# EAGLE design devboard (EAGLE 5.11)
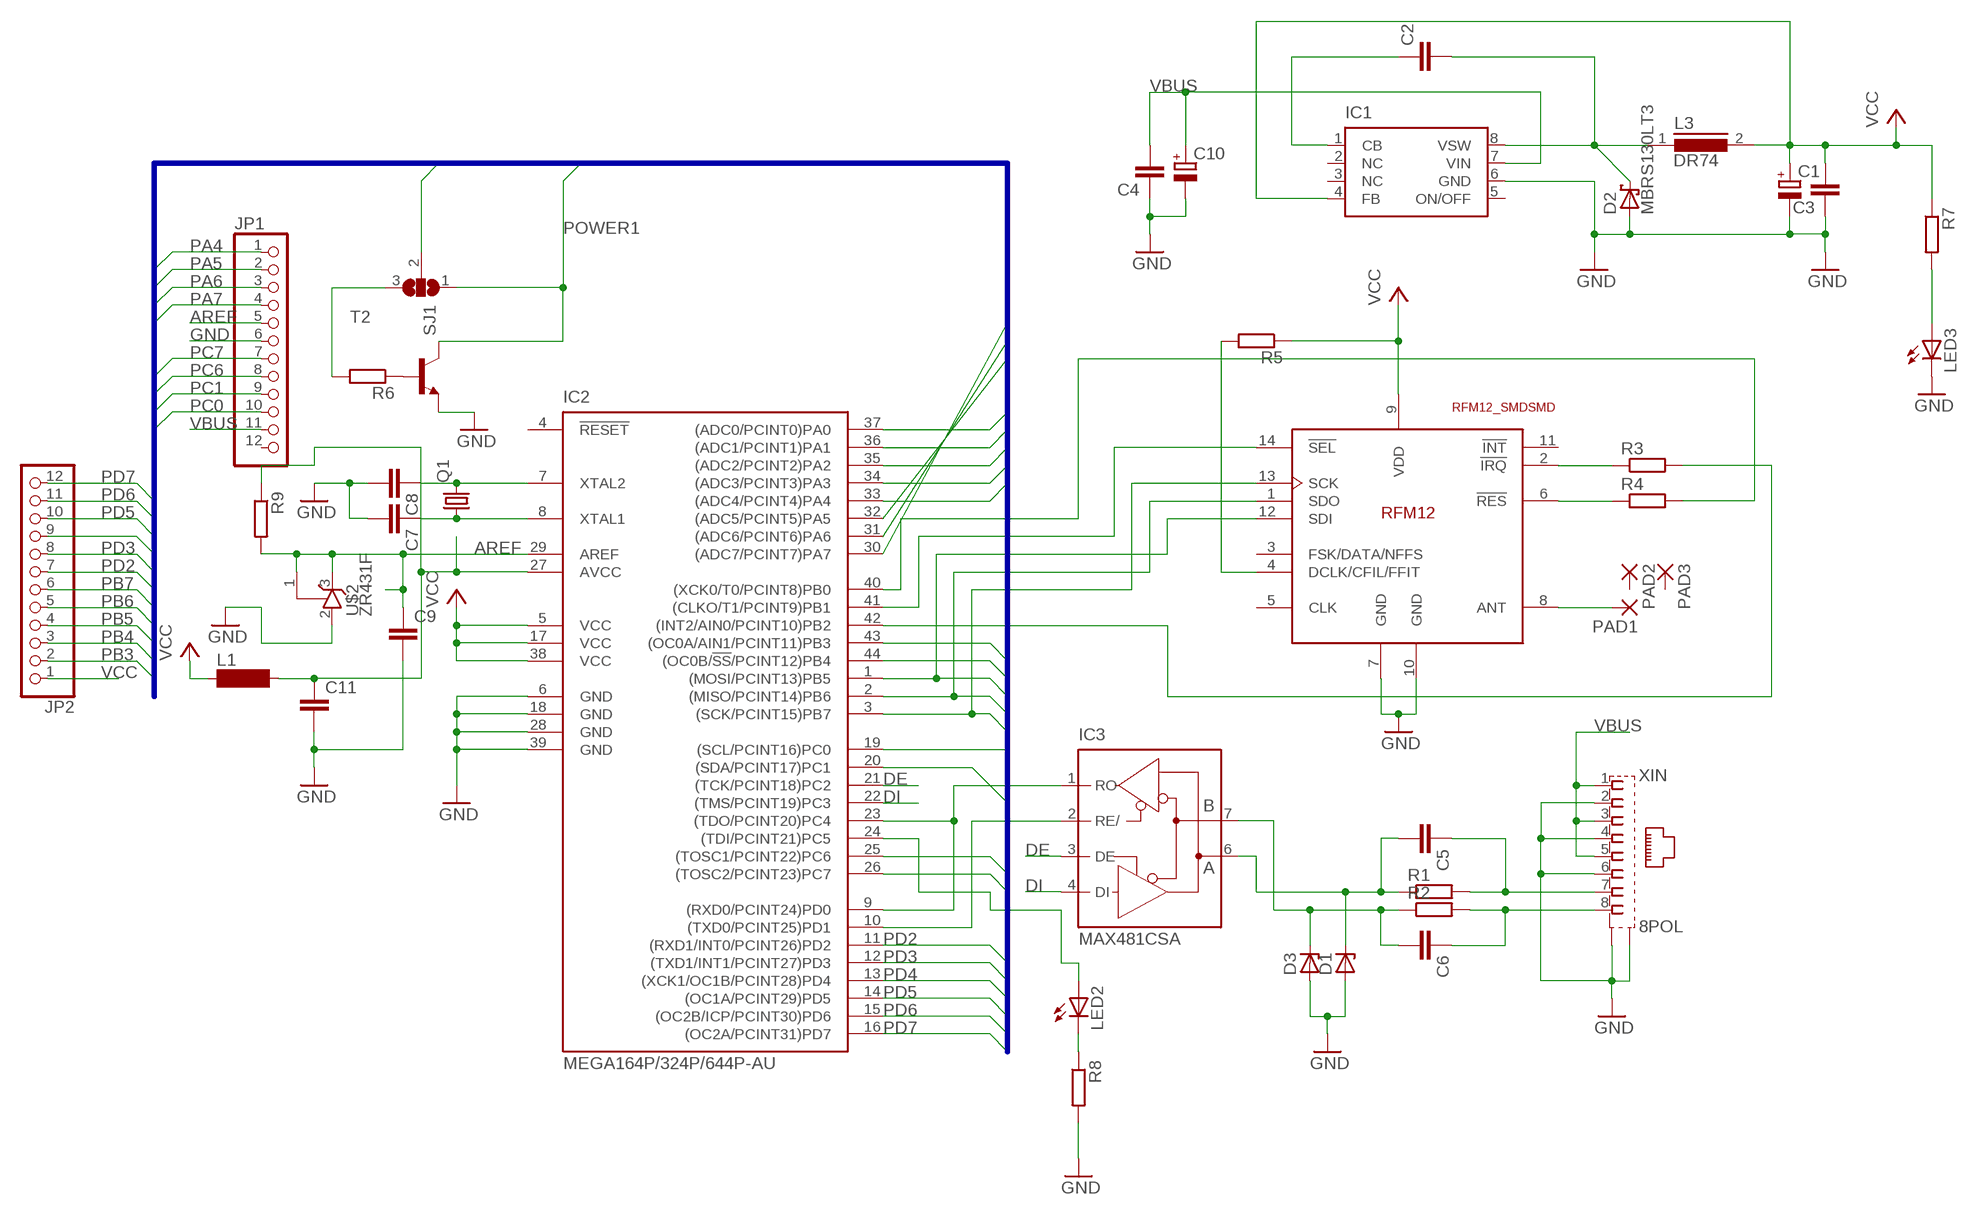
[diagram p0: schematic, sheet 1]

## Parts
C1  CPOL-EUE2.5-5  [E2,5-5]
C2  C-EUC0805K  [C0805K]
C3  C-EUC0805K  [C0805K]
C4  C-EUC0805K  [C0805K]
C5  C-EUC0805K  [C0805K]
C6  C-EUC0805K  [C0805K]
C7  C-EUC0805K  [C0805K]
C8  C-EUC0805K  [C0805K]
C9  C-EUC0805K  [C0805K]
C10  CPOL-EUE2.5-5  [E2,5-5]
C11  C-EUC0805K  [C0805K]
D1  ZENER-DIODESOD80C  [SOD80C]
D2  MBRS130LT3  [SMB]
D3  ZENER-DIODESOD80C  [SOD80C]
IC1  LM2674  [SO8]
IC2  MEGA164P/324P/644P-AU  [TQFP44]
IC3  MAX481CSA  [SO08]
JP1  PINHD-1X12  [1X12]
JP2  PINHD-1X12  [1X12]
L1  SM-1206  [SM-1206]
L3  DR74  [DR74]
LED2  LEDCHIPLED_0805  [CHIPLED_0805]
LED3  LEDCHIPLED_0805  [CHIPLED_0805]
PAD1  SMD2  [SMD1,27-2,54]
PAD2  SMD2  [SMD1,27-2,54]
PAD3  SMD2  [SMD1,27-2,54]
Q1  CRYSTALHC49UP  [HC49UP]
R1  R-EU_R0805  [R0805]
R2  R-EU_R0805  [R0805]
R3  R-EU_R0805  [R0805]
R4  R-EU_R0805  [R0805]
R5  R-EU_R0805  [R0805]
R6  R-EU_R0805  [R0805]
R7  R-EU_R0805  [R0805]
R8  R-EU_R0805  [R0805]
R9  R-EU_R0805  [R0805]
SJ1  SJ2W  [SJ_2]
T2  MMBT2222ALT1-NPN-SOT23-BEC  [SOT23-BEC]
U$1  RFM12_SMDSMD  [RFM12]
U$2  ZR431F  [SOT32]
XIN  8POL  [8POL]

## Nets
AREF: C9.1 IC2.29(AREF) JP1.5 R9.2 U$2.1(R) U$2.3(C)
AVCC: C11.1 IC2.27(AVCC) L1.2 R9.1
DE: IC2.21((TCK/PCINT18)PC2) IC3.3(DE)
DI: IC2.22((TMS/PCINT19)PC3) IC3.4(DI)
GND: C1.- C3.1 C4.1 C7.2 C8.2 C9.2 C10.- C11.2 D1.A D2.A D3.A IC1.6(GND) IC2.6(GND) IC2.18(GND) IC2.28(GND) IC2.39(GND) JP1.6 LED3.C R8.2 T2.E U$1.7(GND) U$1.10(GND) U$2.2(A) XIN.2 XIN.4 XIN.6 XIN.S1 XIN.S2
N$1: C7.1 IC2.8(XTAL1) Q1.1
N$2: C8.1 IC2.7(XTAL2) Q1.2
N$3: IC2.9((RXD0/PCINT24)PD0) IC2.23((TDO/PCINT20)PC4) IC3.1(RO)
N$4: IC2.10((TXD0/PCINT25)PD1) IC3.2(RE/)
N$6: R4.1 U$1.6(!RES)
N$7: R3.1 U$1.2(!IRQ)
N$8: IC2.41((CLKO/T1/PCINT9)PB1) U$1.14(!SEL)
N$9: C2.2 D2.C IC1.8(VSW) L3.1
N$10: C2.1 IC1.1(CB)
N$11: C5.2 D1.C IC3.6(A) R1.1
N$12: R6.2 SJ1.3
N$13: C6.2 D3.C IC3.7(B) R2.1
N$14: IC2.42((INT2/AIN0/PCINT10)PB2) R3.2
N$15: C5.1 R1.2 XIN.7
N$16: C6.1 R2.2 XIN.8
N$17: IC2.40((XCK0/T0/PCINT8)PB0) R4.2
N$18: PAD1.1(P) U$1.8(ANT)
N$19: R5.2 U$1.4(DCLK/CFIL/FFIT)
N$20: R6.1 T2.B
N$21: LED3.A R7.2
N$22: IC2.24((TDI/PCINT21)PC5) LED2.A
N$23: LED2.C R8.1
PA0: IC2.37((ADC0/PCINT0)PA0)
PA1: IC2.36((ADC1/PCINT1)PA1)
PA2: IC2.35((ADC2/PCINT2)PA2)
PA3: IC2.34((ADC3/PCINT3)PA3)
PA4: IC2.33((ADC4/PCINT4)PA4) JP1.1
PA5: IC2.32((ADC5/PCINT5)PA5) JP1.2
PA6: IC2.31((ADC6/PCINT6)PA6) JP1.3
PA7: IC2.30((ADC7/PCINT7)PA7) JP1.4
PB3: IC2.43((OC0A/AIN1/PCINT11)PB3) JP2.2
PB4: IC2.44((OC0B/!SS!/PCINT12)PB4) JP2.3
PB5: IC2.1((MOSI/PCINT13)PB5) JP2.4 U$1.12(SDI)
PB6: IC2.2((MISO/PCINT14)PB6) JP2.5 U$1.1(SDO)
PB7: IC2.3((SCK/PCINT15)PB7) JP2.6 U$1.13(SCK)
PC0: IC2.19((SCL/PCINT16)PC0) JP1.10
PC1: IC2.20((SDA/PCINT17)PC1) JP1.9
PC6: IC2.25((TOSC1/PCINT22)PC6) JP1.8
PC7: IC2.26((TOSC2/PCINT23)PC7) JP1.7
PD2: IC2.11((RXD1/INT0/PCINT26)PD2) JP2.7
PD3: IC2.12((TXD1/INT1/PCINT27)PD3) JP2.8
PD4: IC2.13((XCK1/OC1B/PCINT28)PD4) SJ1.2
PD5: IC2.14((OC1A/PCINT29)PD5) JP2.10
PD6: IC2.15((OC2B/ICP/PCINT30)PD6) JP2.11
PD7: IC2.16((OC2A/PCINT31)PD7) JP2.12
POWER1: JP2.9 SJ1.1 T2.C
VBUS: C4.2 C10.+ IC1.7(VIN) JP1.11 XIN.1 XIN.3 XIN.5
VCC: C1.+ C3.2 IC1.4(FB) IC2.5(VCC) IC2.17(VCC) IC2.38(VCC) JP2.1 L1.1 L3.2 R5.1 R7.1 U$1.9(VDD)
Unconnected: IC1.2(NC) IC1.3(NC) IC1.5(ON/OFF) IC2.4(!RESET) JP1.12 PAD2.1(P) PAD3.1(P) U$1.3(FSK/DATA/NFFS) U$1.5(CLK) U$1.11(!INT)

## Buses
PA[0..7],PB[0..7],PC[0..7],PD[0..7],POWER1,POWER2

## Power pins joined to a net without a drawn wire
GND: IC3.5(GND)
VCC: IC3.8(VCC)

## Library data of the parts
C1 C10 = rcl:CPOL-EU: POLARIZED CAPACITOR, European symbol
C2-C9 C11 = rcl:C-EU: CAPACITOR, European symbol
D1 D3 = diode:ZENER-DIODE: Z-Diode
D2 = diode:MBRS130LT3: Schottky Power Rectifier Source: http://www.onsemi.com/pub/Collateral/MBRS130LT3-D.PDF
IC1 = lm2674:LM2674
IC2 = avr-6:MEGA164P/324P/644P-AU
IC3 = maxim:MAX481CSA: RS485 TRANSEIVER; MF: MAXIM; MPN: MAX481CSA; OC_FARNELL: unknown; OC_NEWARK: 90C3817
JP1 JP2 = pinhead:PINHD-1X12: PIN HEADER
L1 = inductor-neosid:SM-1206: INDUCTOR SMD chip inductor; OC_FARNELL: unknown; OC_NEWARK: unknown
L3 = inductors:DR74: High Power Density, High Efficiency, Shielded Inductors Source: coiltronics_dr_series.pdf
LED2 LED3 = led:LED: LED OSRAM: - CHIPLED LG R971, LG N971, LY N971, LG Q971, LY Q971, LO R971, LY R971 LH N974, LH R974 LS Q976, LO Q976, LY Q976 LO Q996 - Hyper CHIPLED LW Q18S LB Q993, LB Q99A, LB R99A - SideLED LS A670, LO A670, LY A670, LG A670, LP A670 LB A673, LV A673, LT A673, LW A673 LH A674 LY A675 LS A676, LA A676, LO A676, LY A676, LW A676 LS A679, LY A679, LG A679 - Hyper Micro SIDELED® LS Y876, LA Y876, LO Y876, LY Y876 LT Y87S - SmartLED LW L88C, LW L88S LB L89C, LB L89S, LG L890 LS L89K, LO L89K, LY L89K LS L896, LA L896, LO L896, LY L896 - TOPLED LS T670, LO T670, LY T670, LG T670, LP T670 LSG T670, LSP T670, LSY T670, LOP T670, LYG T670 LG T671, LOG T671, LSG T671 LB T673, LV T673, LT T673, LW T673 LH T674 LS T676, LA T676, LO T676, LY T676, LB T676, LH T676, LSB T676, LW T676 LB T67C, LV T67C, LT T67C, LS T67K, LO T67K, LY T67K, LW E67C LS E67B, LA E67B, LO E67B, LY E67B, LB E67C, LV E67C, LT E67C LW T67C LS T679, LY T679, LG T679 LS T770, LO T770, LY T770, LG T770, LP T770 LB T773, LV T773, LT T773, LW T773 LH T774 LS E675, LA E675, LY E675, LS T675 LS T776, LA T776, LO T776, LY T776, LB T776 LHGB T686 LT T68C, LB T68C - Hyper Mini TOPLED® LB M676 - Mini TOPLED Santana® LG M470 LS M47K, LO M47K, LY M47K Source: http://www.osram.convergy.de LUXEON: - LUMILED® LXK2-PW12-R00, LXK2-PW12-S00, LXK2-PW14-U00, LXK2-PW14-V00 LXK2-PM12-R00, LXK2-PM12-S00, LXK2-PM14-U00 LXK2-PE12-Q00, LXK2-PE12-R00, LXK2-PE12-S00, LXK2-PE14-T00, LXK2-PE14-U00 LXK2-PB12-K00, LXK2-PB12-L00, LXK2-PB12-M00, LXK2-PB14-N00, LXK2-PB14-P00, LXK2-PB14-Q00 LXK2-PR12-L00, LXK2-PR12-M00, LXK2-PR14-Q00, LXK2-PR14-R00 LXK2-PD12-Q00, LXK2-PD12-R00, LXK2-PD12-S00 LXK2-PH12-R00, LXK2-PH12-S00 LXK2-PL12-P00, LXK2-PL12-Q00, LXK2-PL12-R00 Source: www.luxeon.com KINGBRIGHT: KA-3528ASYC Source: www.kingbright.com
PAD1-PAD3 = wirepad:SMD2: SMD PAD
Q1 = crystal:CRYSTAL: CRYSTAL; OC_FARNELL: unknown; OC_NEWARK: unknown
R1-R9 = rcl:R-EU_: RESISTOR, European symbol
SJ1 = jumper:SJ2W: SMD solder JUMPER
T2 = transistor:*-NPN-: NPN Transistror BF959 corrected 2008.03.06
U$1 = rfm_12:RFM12_SMD: RFM12 is a low costing ISM band transceiver module implemented with unique PLL. It works signal ranges from 315/433/868/915MHZ bands, comply with FCC, ETSI regulation. The SPI interface is used to communicate with microcontroller for parameter setting.
U$2 = zr431:ZR431F
XIN = con-amp:8POL

## Board
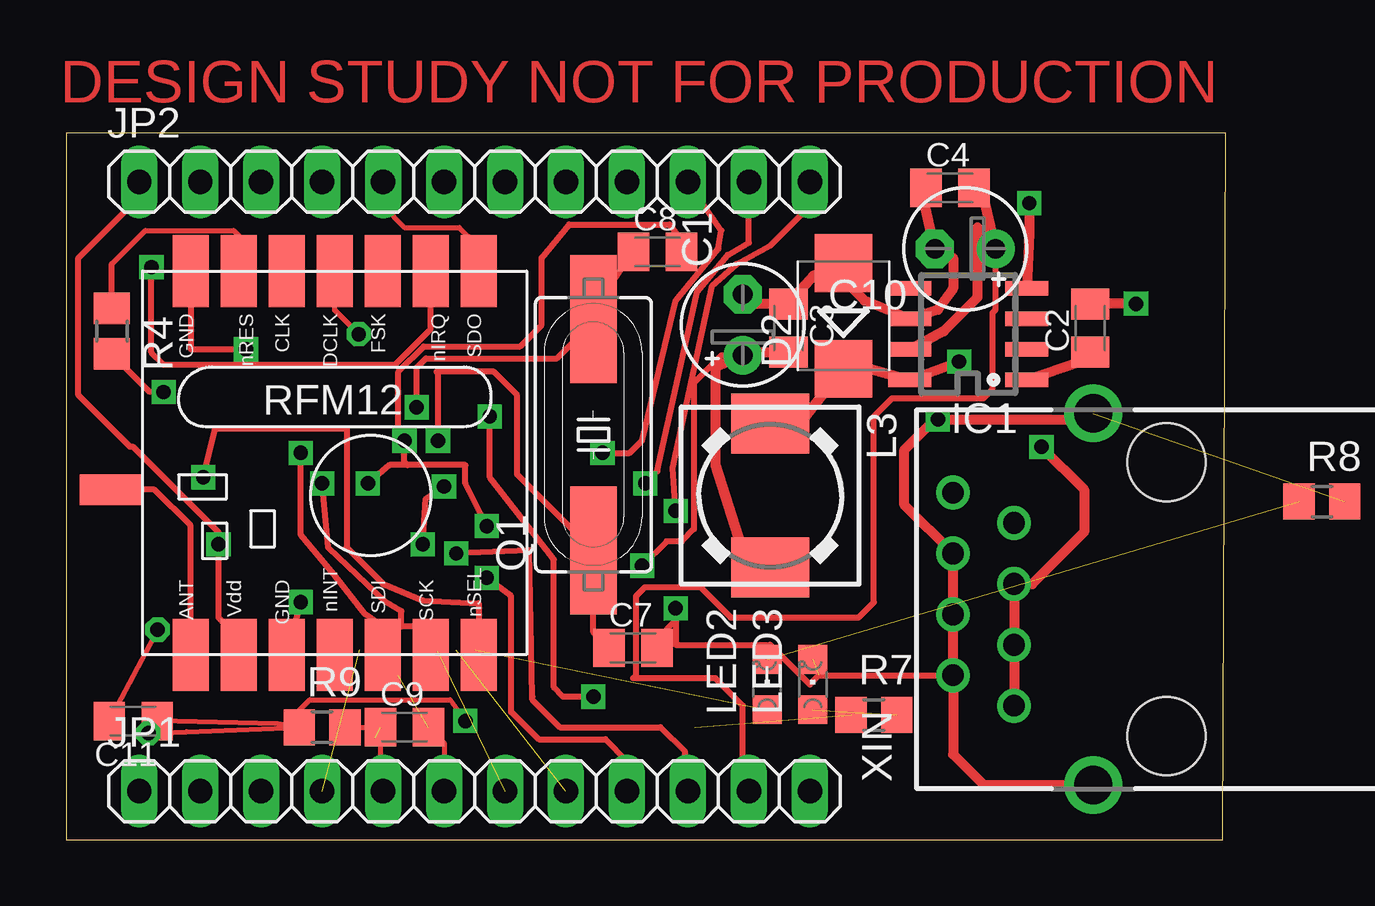
[diagram p1: board, top side]
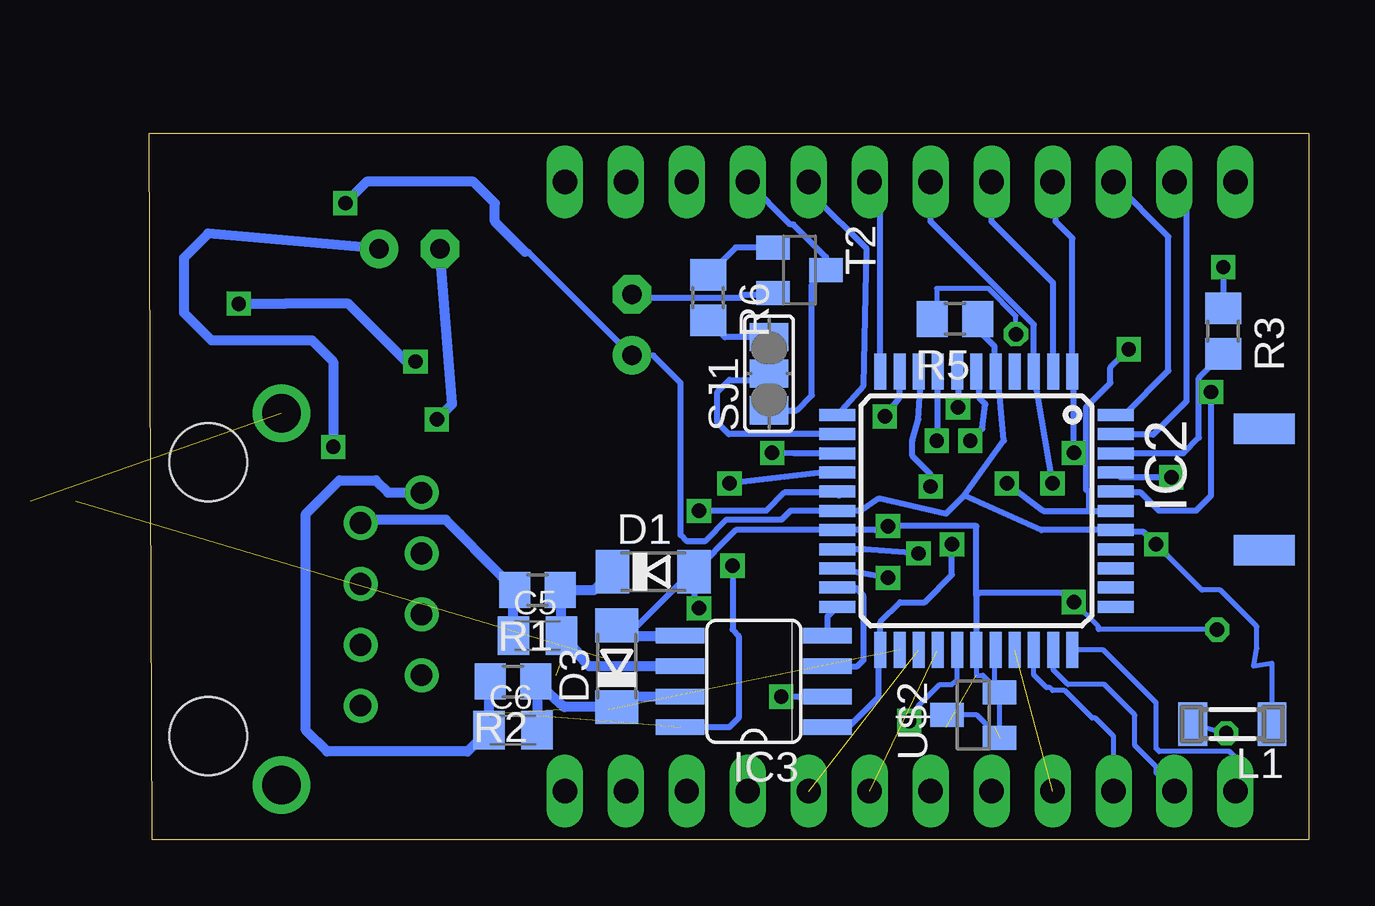
[diagram p2: board, bottom side, seen from below]

Size 48.31 x 29.45 mm. Coordinates in mm from the lower left corner, seen from the top.
Outline: 0,0 48.18,0 48.31,29.45 0,29.45 0,0
Copper layers (1*16): Top 0.035mm / dielectric 1.5mm / Bottom 0.035mm
Design rules "default *": minimum track width 10mil, minimum drill 0.6mm, track to track 8mil, track to pad 8mil, pad to pad 8mil, via to via 8mil, smd to smd 8mil, copper to edge 0.4mm, drill to drill 8mil, minimum pad ring 10mil, minimum via ring 8mil, stop-mask expansion 4mil, vias tented up to drill 0mil, thermal gap 10mil

### Footprints (pad centres in the part's own frame; a part is rotated, then mirrored left to right if it is on the bottom)
E2,5-5 = drill 0.813 pad 1.6 round: + -1.27,0 | drill 0.813 pad 1.6 octagon: - 1.27,0
C0805K = smd 1.3 x 1.6: 1 -1,0; 2 1,0
SOD80C = smd 1.4 x 1.8: A 1.7,0; C -1.7,0
SMB = smd 2.4 x 2.4: A 2.2,0; C -2.2,0
SO8 = smd 0.6 x 1.8: 1 -1.905,-2.44; 2 -0.635,-2.44; 3 0.635,-2.44; 4 1.905,-2.44; 5 1.905,2.44; 6 0.635,2.44; 7 -0.635,2.44; 8 -1.905,2.44
TQFP44 = smd 1.5 x 0.5: 1 -5.8,4; 2 -5.8,3.2; 3 -5.8,2.4; 4 -5.8,1.6; 5 -5.8,0.8; 6 -5.8,0; 7 -5.8,-0.8; 8 -5.8,-1.6; 9 -5.8,-2.4; 10 -5.8,-3.2; 11 -5.8,-4; 23 5.8,-4; 24 5.8,-3.2; 25 5.8,-2.4; 26 5.8,-1.6; 27 5.8,-0.8; 28 5.8,0; 29 5.8,0.8; 30 5.8,1.6; 31 5.8,2.4; 32 5.8,3.2; 33 5.8,4 | smd 0.5 x 1.5: 12 -4,-5.8; 13 -3.2,-5.8; 14 -2.4,-5.8; 15 -1.6,-5.8; 16 -0.8,-5.8; 17 0,-5.8; 18 0.8,-5.8; 19 1.6,-5.8; 20 2.4,-5.8; 21 3.2,-5.8; 22 4,-5.8; 34 4,5.8; 35 3.2,5.8; 36 2.4,5.8; 37 1.6,5.8; 38 0.8,5.8; 39 0,5.8; 40 -0.8,5.8; 41 -1.6,5.8; 42 -2.4,5.8; 43 -3.2,5.8; 44 -4,5.8
SO08 = smd 0.66 x 2.032: 1 -1.905,-3.073; 2 -0.635,-3.073; 3 0.635,-3.073; 4 1.905,-3.073; 5 1.905,3.073; 6 0.635,3.073; 7 -0.635,3.073; 8 -1.905,3.073
1X12 = drill 1.016 long: 1 -13.97,0; 2 -11.43,0; 3 -8.89,0; 4 -6.35,0; 5 -3.81,0; 6 -1.27,0; 7 1.27,0; 8 3.81,0; 9 6.35,0; 10 8.89,0; 11 11.43,0; 12 13.97,0
SM-1206 = smd 1.2 x 1.8: 1 -1.65,0; 2 1.65,0
DR74 = smd 2.5 x 3.25: 1 -3,0; 2 3,0
CHIPLED_0805 = smd 1.2 x 1.2: A 0,-1.05; C 0,1.05
SMD1,27-2,54 = smd 1.27 x 2.54: 1 0,0
HC49UP = smd 5.334 x 1.93: 1 -4.826,0; 2 4.826,0
R0805 = smd 1.3 x 1.5: 1 -0.95,0; 2 0.95,0
SJ_2 = smd 1.168 x 1.6: 1 -1.524,0; 2 0,0; 3 1.524,0
SOT23-BEC = smd 1 x 1.4: B -0.95,-1.1; C 0,1.1; E 0.95,-1.1
RFM12 = smd 1.5 x 3: 1 -5,-10; 2 -3,-10; 3 -1,-10; 4 1,-10; 5 3,-10; 6 5,-10; 7 7,-10; 8 7,6; 9 5,6; 10 3,6; 11 1,6; 12 -1,6; 13 -3,6; 14 -5,6
SOT32 = smd 1 x 1.4: 1 -0.95,-1.1; 2 0.95,-1.1; 3 0,1.1
8POL = drill 0.9 round: 1 -4.445,6.35; 2 -3.175,8.89; 3 -1.905,6.35; 4 -0.635,8.89; 5 0.635,6.35; 6 1.905,8.89; 7 3.175,6.35; 8 4.445,8.89 | drill 1.6 round: S1 -7.745,3.05; S2 7.745,3.05 | hole 3.25: -5.715,0; 5.715,0

### Placement (x,y rotation side)
C1  28.19,21.46 90 top
C2  42.67,21.34 90 top
C3  30.1,21.34 270 top
C4  36.83,27.18 0 top
C5  32.13,8.51 0 bottom
C6  33.15,4.57 0 bottom
C7  23.62,8 0 top
C8  24.64,24.51 0 top
C9  14.1,4.7 0 top
C10  37.47,24.64 180 top
C11  2.79,4.95 180 top
D1  27.3,11.18 0 bottom
D2  32.38,21.84 90 top
D3  28.83,7.24 90 bottom
IC1  37.59,21.08 90 top
IC2  13.84,13.72 270 bottom
IC3  23.11,6.6 90 bottom
JP1  17.02,2.03 0 top
JP2  17.02,27.43 0 top
L1  3.17,4.83 180 bottom
L3  29.34,14.35 270 top
LED2  29.21,6.48 0 top
LED3  31.11,6.48 0 top
PAD1  1.84,14.61 90 top
PAD2  1.84,12.07 270 bottom
PAD3  1.84,17.14 90 bottom
Q1  21.97,16.89 90 top
R1  32.13,10.41 180 bottom
R2  33.15,6.6 180 bottom
R3  3.56,21.21 270 bottom
R4  1.91,21.21 270 top
R5  14.73,21.72 180 bottom
R6  25.02,22.61 270 bottom
R7  33.66,5.21 0 top
R8  52.32,14.1 0 top  (outside the outline)
R9  10.67,4.7 0 top
SJ1  22.48,19.43 90 bottom
T2  21.21,23.75 270 bottom
U$1  12.19,13.72 180 top
U$2  13.97,5.21 90 bottom
XIN  45.85,10.03 90 top

### Tracks (layer width: path | path; a pad name or v marks a point on that pad's centre or on a via)
AREF  (1 unrouted)
  Top 0.203: R9.2 C9.1 13.1,2.14 JP1.5
  Bottom 0.203: 13.08,7.88 13.08,6.16 12.87,5.95 U$2.1 13.82,5.21 U$2.3
  Bottom 0.254: 13.08,7.88 IC2.29
AVCC  (via drill 0.6)
  Top 0.203: C11.1 8.83,4.83 R9.1 | R9.1 5.02,4.51 v3.43,4.44 | v16.64,4.95 16,5.84 10.16,5.84 9.65,5.33 9.65,4.76 R9.1
  Bottom 0.203: v3.43,4.44 L1.2 | v16.64,4.95 16.26,5.59 15.37,6.48 14.86,6.48 14.64,6.69 IC2.27
DE
  Bottom 0.254: IC3.3 18.8,7.24 18.54,7.49 18.54,10.16 18.9,10.52 IC2.21
DI
  Bottom 0.254: IC2.22 20.04,9.32 IC3.4
GND  (via drill 0.6)  (3 unrouted)
  Top 0.203: C11.2 3.83,8.75 v3.81,8.76 | C9.2 15.75,4.05 JP1.6
  Top 0.254: v17.53,13.08 16.64,14.86 16.64,15.62 14.22,15.62 | 14.22,15.62 13.46,15.62 v12.57,14.86 | 14.22,15.62 14.1,15.75 v14.1,16.64 13.84,16.89 IC2.6 14.9,20.57 18.92,20.57 19.81,21.46 19.81,24.26 20.95,25.65 25.15,25.65 25.89,24.65 C8.2 | v25.4,9.65 25.4,9.14 | 25.4,9.14 25.4,8.13 29.33,8.13 30.99,6.48 31.37,6.86 XIN.2 | U$1.10 9.19,7.83 v9.78,9.91 | U$1.7 5.21,22.56 5.21,20.45 v7.49,20.45 | C7.2 24.62,8.37 25.4,9.14
  Top 0.406: 31.91,23.84 31.17,23.54 C3.1 28.59,22.34 C1.- | 31.91,23.84 D2.A | 31.91,23.84 33.28,22.48 IC1.6 36.32,22.1 36.96,22.99 36.96,24.26 C10.- 35.56,27.42 C4.1 | XIN.S2 42.55,17.53 v36.32,17.53 36.2,17.53 34.92,16.26 34.92,13.97 XIN.6 XIN.4 XIN.2 36.96,3.56 38.23,2.29 XIN.S1
  Bottom 0.203: IC2.28 13.84,6.86 13.57,6.86 U$2.2 | v3.81,8.76 8.76,8.76 8.76,8.89 v9.78,9.91
  Bottom 0.254: 9.14,13.72 11.05,13.72 v12.57,14.86 | 9.14,13.72 IC2.39 7.92,13.84 | v14.1,16.64 13.59,17.14 13.46,18.16 13.72,18.41 13.72,19.39 IC2.6 | 28.4,8.51 25.73,11.18 D1.A | D1.A 23.86,12.92 IC2.18 18.07,12.92 v17.53,13.08 13.84,13.08 13.84,10.16 | v25.4,9.65 25.61,9.86 D1.A | 13.84,10.16 IC2.28 | 9.91,9.91 v9.78,9.91 9.78,9.78 9.91,9.91 | 9.91,9.91 10.29,10.29 13.72,10.29 13.84,10.16 | v7.49,20.45 8.26,19.68 8.26,19.05 9.27,18.03 9.27,14.61 9.14,14.48 9.14,13.72 | T2.E 22.38,22.73 23.62,22.73 23.62,22.61 28.07,22.61 C1.-
  Bottom 0.406: C10.- 35.69,18.16 v36.32,17.53 | IC3.5 28.4,8.51 D3.A
N$1  (via drill 0.6)
  Top 0.254: v15.49,16.64 15.49,19.46 IC2.8 17.82,19.52 18.8,18.54 18.8,15.24 Q1.1 21.97,8.65 C7.1
  Bottom 0.254: v15.49,16.64 15.44,16.94 IC2.8
N$2  (via drill 0.6)
  Top 0.254: v14.61,18.03 14.61,19.68 14.99,20.07 20.45,20.07 21.97,21.59 Q1.2 21.97,22.08 C8.1
  Bottom 0.254: IC2.7 14.61,19.48 v14.61,18.03
N$3  (via drill 0.6)
  Top 0.254: v14.86,12.32 14.99,14.22 v15.75,14.73
  Bottom 0.254: IC3.1 19.18,4.7 17.91,5.97 17.91,7.85 IC2.23 17.84,9.08 17.02,9.91 16,9.91 14.86,11.05 v14.86,12.32 14.86,12.45 | v15.75,14.73 15.75,15.24 16.51,16 16.51,16.64 16.26,17.53 16.13,19.4 IC2.9
N$4  (via drill 0.6)
  Top 0.254: v21.97,5.97 20.7,5.97 20.32,6.35 20.32,11.68 17.65,15.11 v17.65,17.65
  Bottom 0.254: IC3.2 v21.97,5.97 | v17.65,17.65 17.04,18.44 IC2.10
N$6
  Top 0.203: 1.91,24 3.3,25.4 6.99,25.4 7.24,25.15 7.24,23.11 | 7.24,23.11 7.24,22.99 6.99,22.73 | U$1.6 7.19,23.16 7.24,23.11
  Top 0.254: R4.1 1.91,24 | 7.24,24.26 7.24,23.11 7.24,22.62 U$1.6
N$7  (via drill 0.6)
  Top 0.254: v3.56,23.88 3.56,20.32 4.06,19.81 13.72,19.81 15.19,21.29 U$1.2
  Bottom 0.254: v3.56,23.88 R3.1
N$8  (via drill 0.6)
  Top 0.254: U$1.14 17.19,9.86 14.86,9.99 13.21,10.67 11.68,12.19 11.68,17.14 6.22,17.14 v5.71,15.11
  Bottom 0.254: v5.71,15.11 7.84,15.11 IC2.41
N$9  (via drill 0.6)
  Top 0.406: D2.C 32.81,19.56 | D2.C 30.6,17.35 L3.1 | D2.C 33.46,19.64 IC1.8 v37.21,19.94 | v44.58,22.35 42.69,22.35 C2.2
  Bottom 0.406: v37.21,19.94 37.59,19.94 40.01,22.35 42.66,22.35 C2.2 44.56,22.34 v44.58,22.35
N$10
  Top 0.406: IC1.1 42.27,19.94 C2.1
N$11
  Bottom 0.406: IC3.6 29.97,7.24 30.48,7.75 30.48,7.86 C5.2 31.13,10.36 R1.1 29.77,10.41 D1.C
N$12
  Bottom 0.254: SJ1.3 24.32,20.95 R6.2
N$13
  Bottom 0.406: IC3.7 28.4,5.97 D3.C 31,5.54 R2.1 32.15,6.53 C6.2
N$14
  Bottom 0.254: IC2.42 5.22,16.12 4.57,16.76 4.57,19.24 R3.2
N$15
  Bottom 0.406: XIN.7 39.37,13.34 35.94,13.34 35.37,12.76 R1.2 33.13,10.36 C5.1
N$16
  Bottom 0.406: XIN.8 38.35,14.48 38.86,14.99 40.39,14.99 41.78,13.59 41.78,4.57 40.89,3.68 35.04,3.68 C6.1 34.15,6.43 R2.2
N$17  (via drill 0.6)
  Top 0.254: v4.06,18.67 3.5,18.67 R4.2
  Bottom 0.254: IC2.40 8.01,14.48 6.99,14.48 6.22,13.72 4.7,13.72 4.06,14.35 v4.06,18.67
N$18
  Top 0.254: U$1.8 5.19,13.1 3.68,14.61 PAD1.1
N$19  (via drill 0.6)
  Top 0.203: v12.19,21.08 11.19,22.08 U$1.4
  Bottom 0.203: R5.2 15.49,21.72 15.49,22.99 13.34,22.99 12.19,21.84 v12.19,21.08
N$20
  Bottom 0.254: T2.B 23.88,24.7 R6.1
N$21  (1 unrouted)
N$22  (1 unrouted)
N$23  (1 unrouted)
PA4
  Bottom 0.203: IC2.33 8.55,7.92 6.35,5.71 6.35,3.81 6.22,3.68 3.3,3.68 2.79,3.17 2.79,2.29 JP1.1
PA5
  Bottom 0.203: IC2.32 10.64,7.09 10.03,6.48 8.51,6.48 7.24,5.21 7.24,3.94 6.35,3.05 6.35,2.79 JP1.2
PA6
  Bottom 0.203: IC2.31 11.44,6.87 10.92,6.35 10.79,6.35 10.67,6.22 10.16,6.22 9.02,5.08 8.89,5.08 8.13,4.32 JP1.3
PA7  (1 unrouted)
PB3
  Bottom 0.254: JP2.2 5.08,26.92 5.08,18.29 6.48,16.89 8.02,16.89 IC2.43 7.47,16.92
PB4
  Bottom 0.254: JP2.3 5.84,25.15 5.84,19.56 7.68,17.72 IC2.44
PB5  (via drill 0.6)
  Top 0.254: U$1.12 13.19,8.91 12.45,9.41 11.18,11.05 9.78,12.7 v9.78,16.13
  Bottom 0.254: JP2.4 10.54,27.3 10.54,25.78 9.84,25.08 IC2.1 9.78,19.45 v9.78,16.13
PB6
  Top 0.203: JP2.5 13.21,26.42 14.1,25.53 16.38,25.53 17.02,24.89
  Top 0.254: U$1.1 17.02,22.75 17.02,24.89 16.76,25.15
  Bottom 0.254: IC2.2 10.64,23.22 13.21,25.78 JP2.5
PB7  (via drill 0.6)
  Top 0.254: U$1.13 15.19,8.05 15.11,8.05 15.11,8.89 13.97,8.89 13.97,9.53 13.34,9.91 10.92,12.19 v10.67,14.86
  Bottom 0.254: JP2.6 15.75,25.78 11.44,21.48 IC2.3 11.43,19.38 v10.67,14.86
PC0  (via drill 0.6)
  Top 0.254: v16.26,11.94 19.3,12.07 19.43,5.97 19.43,5.84 20.57,4.7 24.77,4.7 25.78,3.68 25.78,2.16 JP1.10
  Bottom 0.254: v16.26,11.94 18.49,12.12 IC2.19
PC1  (via drill 0.6)
  Top 0.254: v17.53,10.92 18.54,10.16 18.54,5.33 19.68,4.19 22.48,4.19 23.37,3.3 JP1.9
  Bottom 0.254: v17.53,10.92 19.63,11.3 IC2.20
PC6  (1 unrouted)
  Bottom 0.254: IC2.25 16.26,7.9
PC7  (1 unrouted)
  Bottom 0.254: IC2.26 15.49,7.87
PD2
  Bottom 0.254: IC2.11 17.84,26.99 JP2.7
PD3
  Bottom 0.254: IC2.12 18.54,18.94 18.41,24.64 20.57,26.8 20.83,26.8 JP2.8
PD4
  Bottom 0.254: IC2.13 24.16,16.92 24.64,17.4 24.64,18.67 24.13,19.18 22.73,19.18 SJ1.2
PD5  (via drill 0.6)
  Top 0.254: v22.35,16.13 23.5,16.13 24,16.64 25.4,22.48 27.18,24.64 27.3,25.4 JP2.10
  Bottom 0.254: IC2.14 21.45,16.12 v22.35,16.13
PD6  (via drill 0.6)
  Top 0.254: v24.13,14.86 24.64,15.37 26.29,22.86 27.56,24.38 28.45,24.89 JP2.11
  Bottom 0.254: IC2.15 19.69,15.37 v24.13,14.86
PD7  (via drill 0.6)
  Top 0.254: v25.4,13.72 25.27,15.49 26.92,23.11 27.94,24 29.34,24.77 30.99,26.42 JP2.12
  Bottom 0.254: IC2.16 19.64,14.44 | 19.64,14.44 19.56,14.35 | 19.64,14.44 19.68,14.48 21.84,14.48 22.61,13.72 v25.4,13.72
POWER1
  Bottom 0.254: SJ1.1 21.34,17.91 20.7,18.54 20.7,23.16 T2.C 20.11,24.3 21.46,25.65 21.59,25.65 JP2.9
VBUS  (via drill 0.6)
  Top 0.254: JP1.11 28.19,2.29 28.19,5.59 27.05,6.73 23.62,6.73 23.75,6.86 23.75,10.16 24.13,10.54 26.42,10.54 27.69,9.27 33.02,9.27 33.66,9.91 33.66,17.65 34.42,18.41 38.23,18.41 38.61,18.8 38.61,21.97 38.73,22.1 C10.+
  Top 0.406: IC1.7 36.58,21.21 37.97,22.61 37.97,25.53 C10.+ 38.1,27.42 C4.2 | XIN.1 XIN.3 XIN.5 40.26,10.67 42.42,12.83 42.42,14.61 v40.64,16.38
  Bottom 0.406: v40.64,16.38 40.64,19.94 41.53,20.83 45.72,20.83 46.86,21.97 46.86,24.26 45.85,25.27 C10.+
VCC  (via drill 0.6)  (1 unrouted)
  Top 0.254: v24,11.43 25.02,12.45 25.65,12.45 26.16,12.95 26.16,19.05 27.3,20.19 C1.+ | U$1.9 7.24,6.62 7.24,8.38 6.35,9.27 v6.35,12.32 6.35,12.83 2.79,16.38 2.67,16.38 0.51,18.54 0.51,24.26 3.05,26.8 JP2.1
  Top 0.406: IC1.4 40.13,25.3 v40.13,26.54 | C3.2 28.34,20.34 C1.+ 27.05,19.68 27.05,15.62 28.4,11.35 L3.2
  Bottom 0.203: L1.1 1.52,5.97 1.52,7.37 2.29,7.24 2.16,8 2.16,8.89 3.68,10.41 4.45,10.41 v6.35,12.32
  Bottom 0.254: 14.35,14.35 12.7,16.64 12.95,19.43 IC2.5 13.08,19.55 13.08,20.57 13.78,21.27 R5.1 | 14.35,14.35 15.11,13.59 17.91,14.22 18.67,13.72 IC2.17 21.59,13.72 21.97,13.34 24.26,13.34 25.15,12.45 25.91,12.45 26.16,12.7 26.16,19.05 27.3,20.19 C1.+ 32.51,24.51 32.64,24.51 | 14.35,14.35 11.14,12.92 IC2.38 7.95,12.83 6.86,12.83 v6.35,12.32 | IC3.8 24.13,4.7 23.75,5.08 23.75,8.51 24,8.76 v24,11.43
  Bottom 0.406: 32.64,24.51 33.91,25.78 33.91,26.54 34.8,27.43 39.24,27.43 v40.13,26.54

### Text on the board
Top: DESIGN STUDY NOT FOR PRODUCTION